# Altium schematic sheet STM32.SchDoc
size A4
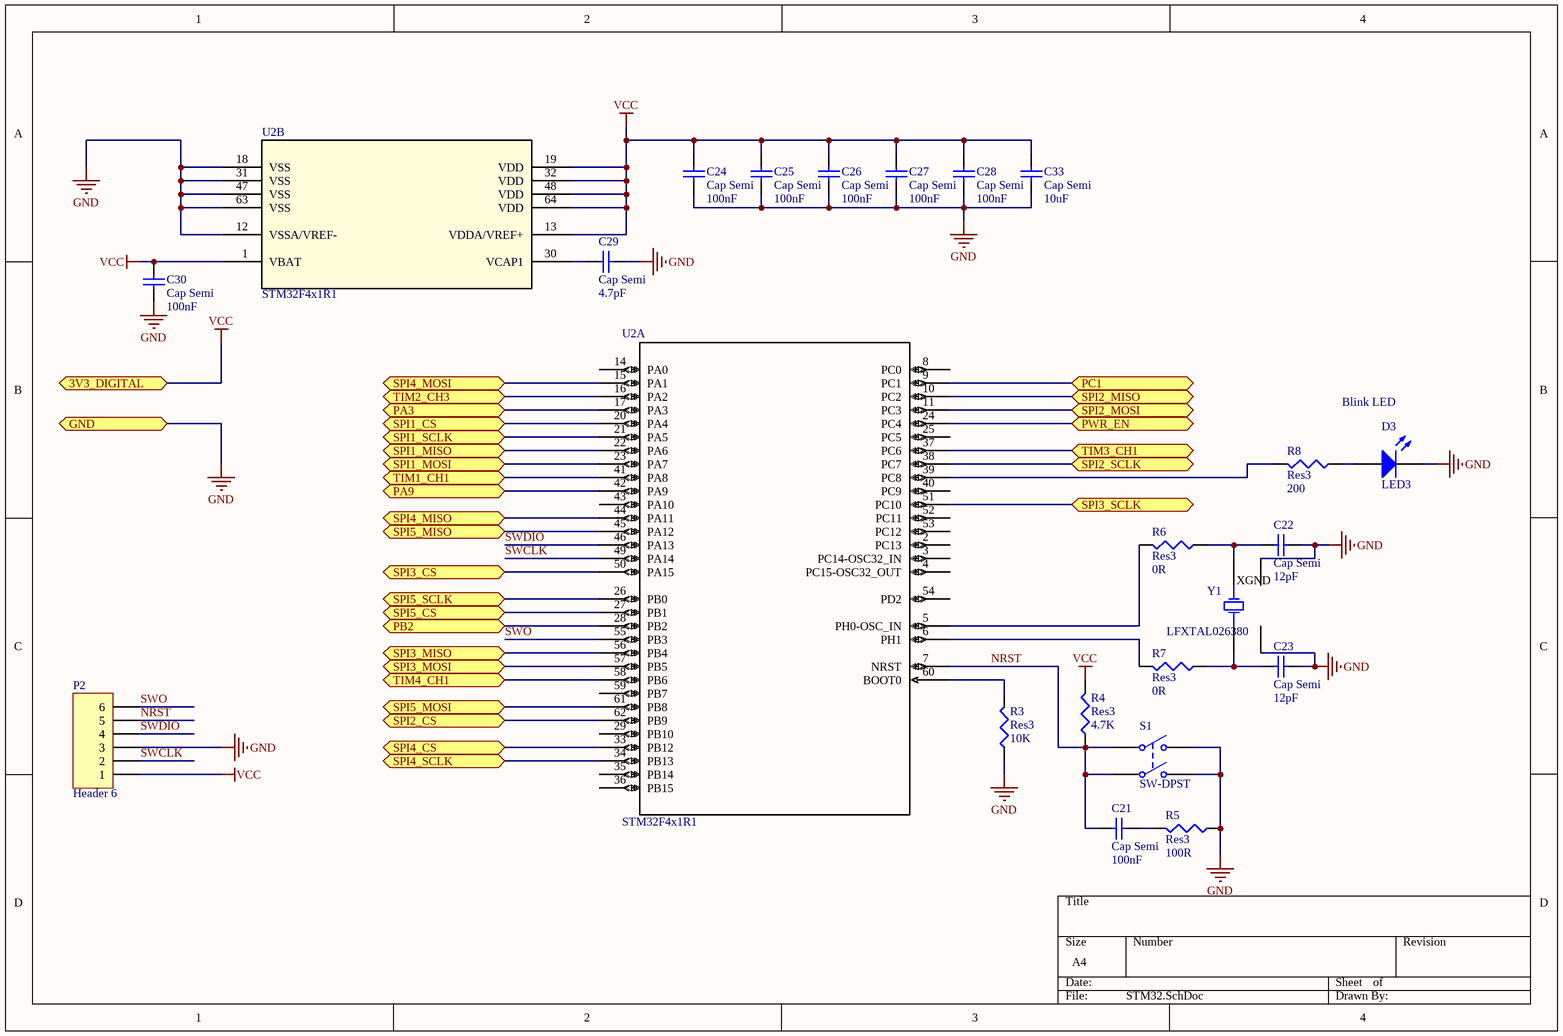
[diagram p0: STM32.SchDoc]

## Parts
C21  Cap Semi  value 100nF  [C1206]
C22  Cap Semi  value 12pF  [C1206]
C23  Cap Semi  value 12pF  [C1206]
C24  Cap Semi  value 100nF  [C1206]
C25  Cap Semi  value 100nF  [C1206]
C26  Cap Semi  value 100nF  [C1206]
C27  Cap Semi  value 100nF  [C1206]
C28  Cap Semi  value 100nF  [C1206]
C29  Cap Semi  value 4.7pF  [C1206]
C30  Cap Semi  value 100nF  [C1206]
C33  Cap Semi  value 10uF  [C1210]
D3  LED3  [3.5X2.8X1.9]
P2  Header 6  [HDR1X6]
R3  Res3  value 10K  [J1-0603]
R4  Res3  value 4.7K  [J1-0603]
R5  Res3  value 100R  [J1-0603]
R6  Res3  value 0R  [J1-0603]
R7  Res3  value 0R  [J1-0603]
R8  Res3  value 200  [J1-0603]
S1  SW-DPST  [TACT_SWITCH]
U2  STM32F4x1R1  [LQFP64-10x10mm]  (parts A,B of 2)
Y1  LFXTAL026380  [12SMX-B]

## Ports
3V3_DIGITAL, GND, PA3, PA9, PB2, PC1, PWR_EN, SPI1_CS, SPI1_MISO, SPI1_MOSI, SPI1_SCLK, SPI2_CS, SPI2_MISO, SPI2_MOSI, SPI2_SCLK, SPI3_CS, SPI3_MISO, SPI3_MOSI, SPI3_SCLK, SPI4_CS, SPI4_MISO, SPI4_MOSI, SPI4_SCLK, SPI5_CS, SPI5_MISO, SPI5_MOSI, SPI5_SCLK, TIM1_CH1, TIM2_CH3, TIM3_CH1, TIM4_CH1

## Nets
GND: C22.1 C23.1 C24.2 C25.2 C26.2 C27.2 C28.2 C29.1 C30.1 C33.2 D3.2(K) P2.3 R3.1 R5.1 S1.2(NO1) S1.4(NO2) U2.12(VSSA/VREF-) U2.18(VSS) U2.31(VSS) U2.47(VSS) U2.63(VSS) Y1.2(OSC2) Y1.4(OSC1) ; port GND
VCC: C24.1 C25.1 C26.1 C27.1 C28.1 C30.2 C33.1 P2.1 R4.2 U2.1(VBAT) U2.13(VDDA/VREF+) U2.19(VDD) U2.32(VDD) U2.48(VDD) U2.64(VDD) ; port 3V3_DIGITAL
NRST: C21.2 P2.5 R4.1 S1.1(COMMON1) S1.3(COMMON2) U2.7(NRST)
PA3: U2.17(PA3) ; port PA3
PA9: U2.42(PA9) ; port PA9
PB2: U2.28(PB2) ; port PB2
PC1: U2.9(PC1) ; port PC1
PWR_EN: U2.24(PC4) ; port PWR_EN
SPI1_CS: U2.20(PA4) ; port SPI1_CS
SPI1_MISO: U2.22(PA6) ; port SPI1_MISO
SPI1_MOSI: U2.23(PA7) ; port SPI1_MOSI
SPI1_SCLK: U2.21(PA5) ; port SPI1_SCLK
SPI2_CS: U2.62(PB9) ; port SPI2_CS
SPI2_MISO: U2.10(PC2) ; port SPI2_MISO
SPI2_MOSI: U2.11(PC3) ; port SPI2_MOSI
SPI2_SCLK: U2.38(PC7) ; port SPI2_SCLK
SPI3_CS: U2.50(PA15) ; port SPI3_CS
SPI3_MISO: U2.56(PB4) ; port SPI3_MISO
SPI3_MOSI: U2.57(PB5) ; port SPI3_MOSI
SPI3_SCLK: U2.51(PC10) ; port SPI3_SCLK
SPI4_CS: U2.33(PB12) ; port SPI4_CS
SPI4_MISO: U2.44(PA11) ; port SPI4_MISO
SPI4_MOSI: U2.15(PA1) ; port SPI4_MOSI
SPI4_SCLK: U2.34(PB13) ; port SPI4_SCLK
SPI5_CS: U2.27(PB1) ; port SPI5_CS
SPI5_MISO: U2.45(PA12) ; port SPI5_MISO
SPI5_MOSI: U2.61(PB8) ; port SPI5_MOSI
SPI5_SCLK: U2.26(PB0) ; port SPI5_SCLK
SWCLK: P2.2 U2.49(PA14)
SWDIO: P2.4 U2.46(PA13)
SWO: P2.6 U2.55(PB3)
TIM1_CH1: U2.41(PA8) ; port TIM1_CH1
TIM2_CH3: U2.16(PA2) ; port TIM2_CH3
TIM3_CH1: U2.37(PC6) ; port TIM3_CH1
TIM4_CH1: U2.58(PB6) ; port TIM4_CH1
NetC21_1: C21.1 R5.2
NetC22_2: C22.2 R6.1 Y1.3(OSC2)
NetC23_2: C23.2 R7.1 Y1.1(OSC1)
NetC29_2: C29.2 U2.30(VCAP1)
NetD3_1: D3.1(A) R8.1
NetR3_2: R3.2 U2.60(BOOT0)
NetR6_2: R6.2 U2.5(PH0-OSC_IN)
NetR7_2: R7.2 U2.6(PH1)
NetR8_2: R8.2 U2.39(PC8)

Not connected (* = marked no-connect by the designer): U2 2(PC13) 3(PC14-OSC32_IN) 4(PC15-OSC32_OUT) 8(PC0) 14(PA0) 25(PC5) 29(PB10) 35(PB14) 36(PB15) 40(PC9) 43(PA10) 52(PC11) 53(PC12) 54(PD2) 59(PB7)

## Notes on the sheet
- Blink LED
- (in symbol LFXTAL026380) XGND

## Library data of the parts
C21-C30 C33 = Cap Semi: Capacitor (Semiconductor SIM Model); Published: 8-Jun-2000; LatestRevisionDate: 29-May-2009; LatestRevisionNote: IPC-7351 Footprint Added.; PackageReference: C1206; Publisher: Altium Limited; PackageDescription: Chip Capacitor
D3 = LED3: Typical BLUE SiC LED; Published: 8-Jun-2000; LatestRevisionDate: 17-Dec-2003; LatestRevisionNote: PCB Footprint replaced.; DatasheetVersion: 16-Apr-2002; PackageVersion: 16-Apr-2002; PackageReference: 3.5X2.8X1.9; Publisher: Altium Limited; PackageDescription: SM LED; 2 C-Bend Leads; Body 3.5 x 2.8 x 1.9 mm, inc leads (LxWxH typ)
P2 = Header 6: Header, 6-Pin; LatestRevisionDate: 17-Jul-2002; LatestRevisionNote: Re-released for DXP Platform.; Publisher: Altium Limited
R3-R8 = Res3: Resistor; Published: 8-Jun-2000; LatestRevisionDate: 29-May-2009; LatestRevisionNote: IPC-7351 Footprint Added.; PackageReference: J1-0603; Publisher: Altium Limited; PackageDescription: Chip Resistor
S1 = SW-DPST: Double-Pole, Single-Throw Switch; Published: 24-Mar-1999; LatestRevisionDate: 17-Jul-2002; LatestRevisionNote: Re-released for DXP Platform.; PackageReference: DPST-4; Publisher: Altium Limited; PackageDescription: Switch; 4 Leads
U2 = STM32F4x1R1: Imported; Vendor: STMicroelectronics; C: Copyright (C) 2016 Accelerated Designs. All rights reserved; Manufacturer_Part_Number: stm32f4x1r1; Copyright: Copyright (C) 2016 Accelerated Designs. All rights reserved; RefDes: RefDes; Type: Type; Value: Value